# Altium schematic sheet 1.SchDoc
size A4; Название устройства: Relay Detection
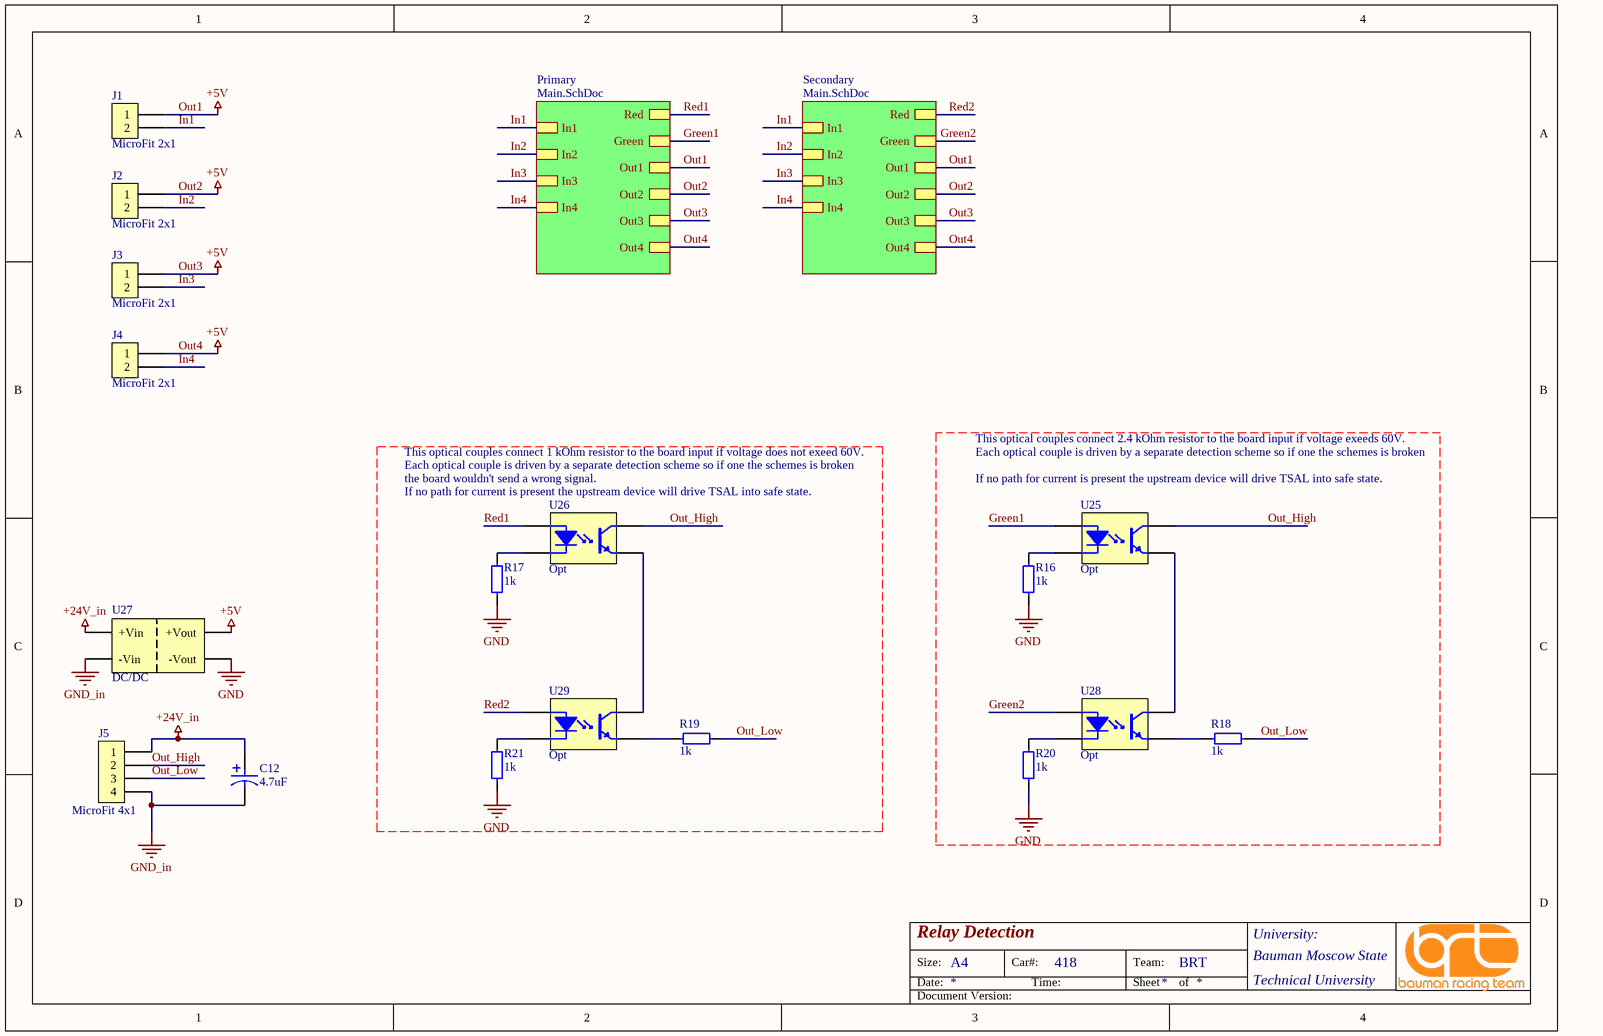
[diagram p0: 1.SchDoc]

## Parts
*  BRT Log  [BRT_Log]  (value not drawn)
C12  4.7uF  [Bar Cap 4x5.4]
J1  MicroFit 2x1  [MolexMicroFit 2x1]
J2  MicroFit 2x1  [MolexMicroFit 2x1]
J3  MicroFit 2x1  [MolexMicroFit 2x1]
J4  MicroFit 2x1  [MolexMicroFit 2x1]
J5  MicroFit 4x1  [MolexMicroFit 4x1]
R16  1k  [0603 Resistor]
R17  1k  [0603 Resistor]
R18  1k  [0603 Resistor]
R19  1k  [0603 Resistor]
R20  1k  [0603 Resistor]
R21  1k  [0603 Resistor]
U25  Opt  [FAIR-MDIP-4_V]
U26  Opt  [FAIR-MDIP-4_V]
U27  DC/DC  [SIP7]
U28  Opt  [FAIR-MDIP-4_V]
U29  Opt  [FAIR-MDIP-4_V]

## Sub-sheets
Primary = Main.SchDoc: Red, In1, Out3, In2, In3, Out1, Green, Out4, In4, Out2
Secondary = Main.SchDoc: Red, In1, Out3, In2, In3, Out1, Green, Out4, In4, Out2

## Nets
+24V_in: C12.2 J5.1 U27.1(+Vin)
GND: R16.1 R17.1 R20.1 R21.1 U27.4(-Vout)
GND_in: C12.1 J5.4 U27.2(-Vin)
Out1: J1.1 J2.1 J3.1 J4.1 U27.6(+Vout) ; sheet Primary/Out3, sheet Primary/Out1, sheet Primary/Out4, sheet Primary/Out2, sheet Secondary/Out3, sheet Secondary/Out1, sheet Secondary/Out4, sheet Secondary/Out2  [also labelled +5V, Out2, Out3, Out4]
Green1: U25.1(ANODE) ; sheet Primary/Green
Green2: U28.1(ANODE) ; sheet Secondary/Green
In1: J1.2 ; sheet Primary/In1, sheet Secondary/In1
In2: J2.2 ; sheet Primary/In2, sheet Secondary/In2
In3: J3.2 ; sheet Primary/In3, sheet Secondary/In3
In4: J4.2 ; sheet Primary/In4, sheet Secondary/In4
Out_High: J5.2 U25.4(COLLECTOR) U26.4(COLLECTOR)
Out_Low: J5.3 R18.1 R19.1
Red1: U26.1(ANODE) ; sheet Primary/Red
Red2: U29.1(ANODE) ; sheet Secondary/Red
NetR16_2: R16.2 U25.2(CATHODE)
NetR17_2: R17.2 U26.2(CATHODE)
NetR18_2: R18.2 U28.3(EMITTER)
NetR19_2: R19.2 U29.3(EMITTER)
NetR20_2: R20.2 U28.2(CATHODE)
NetR21_2: R21.2 U29.2(CATHODE)
NetU25_3: U25.3(EMITTER) U28.4(COLLECTOR)
NetU26_3: U26.3(EMITTER) U29.4(COLLECTOR)

## Notes on the sheet
- This optical couples connect 2.4 kOhm resistor to the board input if voltage exeeds 60V.
- This optical couples connect 1 kOhm resistor to the board input if voltage does not exeed 60V.
- (near U26) Each optical couple is driven by a separate detection scheme so if one the schemes is broken
- (near U26) the board wouldn't send a wrong signal.
- (near U26) If no path for current is present the upstream device will drive TSAL into safe state.
- Each optical couple is driven by a separate detection scheme so if one the schemes is broken
- (near U25) If no path for current is present the upstream device will drive TSAL into safe state.
- Size:
- Date:
- A4
- Car#:
- Time:
- 418
- Team:
- Sheet
- BRT
- of
- University:
- Technical University
- Bauman Moscow State
- Document Version:

## Library data of the parts
* = BRT Log: Team Logo
C12 = Cap Pol 4.7uF: ECAP SMD,  35V, 105°C; Part Number: B41121A7475M000; Manufacturer: Epcos; Type: Capacitor; ComponentLink1Description: Chip&Dip; ComponentLink1URL: https://www.chipdip.ru/product/b41121a7475m000
J1-J4 = Conn 2 [MicroFit]: Micro-Fit 3.0 Right-Angle Header, 3.00mm Pitch, Single Row, 2 Circuits, with Snap-in Plastic Peg PCB Lock, Tin, Glow-Wire Capable, Black; Part Number: 436500200; Manufacturer: Molex; ComponentLink1Description: Molex; ComponentLink1URL: https://www.molex.com/molex/products/part-detail/pcb_headers/0436500200; Type: Connector
J5 = Conn 4 [MicroFit]: Micro-Fit 3.0 Right-Angle Header, 3.00mm Pitch, Single Row, 4 Circuits, with Snap-in Plastic Peg PCB Lock, Tin, Glow-Wire Capable, Black; Part Number: 436500400; Manufacturer: Molex; ComponentLink1Description: Molex; ComponentLink1URL: https://www.molex.com/molex/products/part-detail/pcb_headers/0436500400; Type: Connector
R16-R21 = Res 1k (0603): 0.1W 0603 1k, 1%; Part Number: RC0603FR-071KL; Manufacturer: Taiwan; Type: Resistor; ComponentLink1Description: Chip&Dip; ComponentLink1URL: https://www.chipdip.ru/product0/9000079676
U25 U26 U28 U29 = Optocoupler [FOD817B]: Phototransistor Optocoupler, 4 us Rise, 3 us Fall, 5000 Vrms, -55 to 110 degC, 4-Pin MDIP, RoHS, Tape and Reel; Manufacturer: ON Semiconductor; Part Nomber: FOD817B; ComponentLink1Description: Chip&Dip; ComponentLink1URL: https://www.chipdip.ru/product/fod817b; ComponentLink2Description: DataSheet; ComponentLink2URL: https://static.chipdip.ru/lib/297/DOC000297284.pdf
U27 = DC/DC Isolated 12V [TMH]: The TMH series are ultra miniature, isolated 2 Watt DC/DC-converters in a Single-in-Line  package  (SIP); Manufacturer: Traco Power; Part Number: TMH2412S; Input Voltage: 24; Output Voltage: 12; ComponentLink1Description: Chip&Dip; ComponentLink1URL: https://www.chipdip.ru/product/tmv2412s; ComponentLink2Description: DataSheet; ComponentLink2URL: https://static.chipdip.ru/lib/005/DOC001005854.pdf; Type: IC